# Altium schematic sheet Core.SchDoc
size A3; SheetNumber: 1; SheetTotal: 3
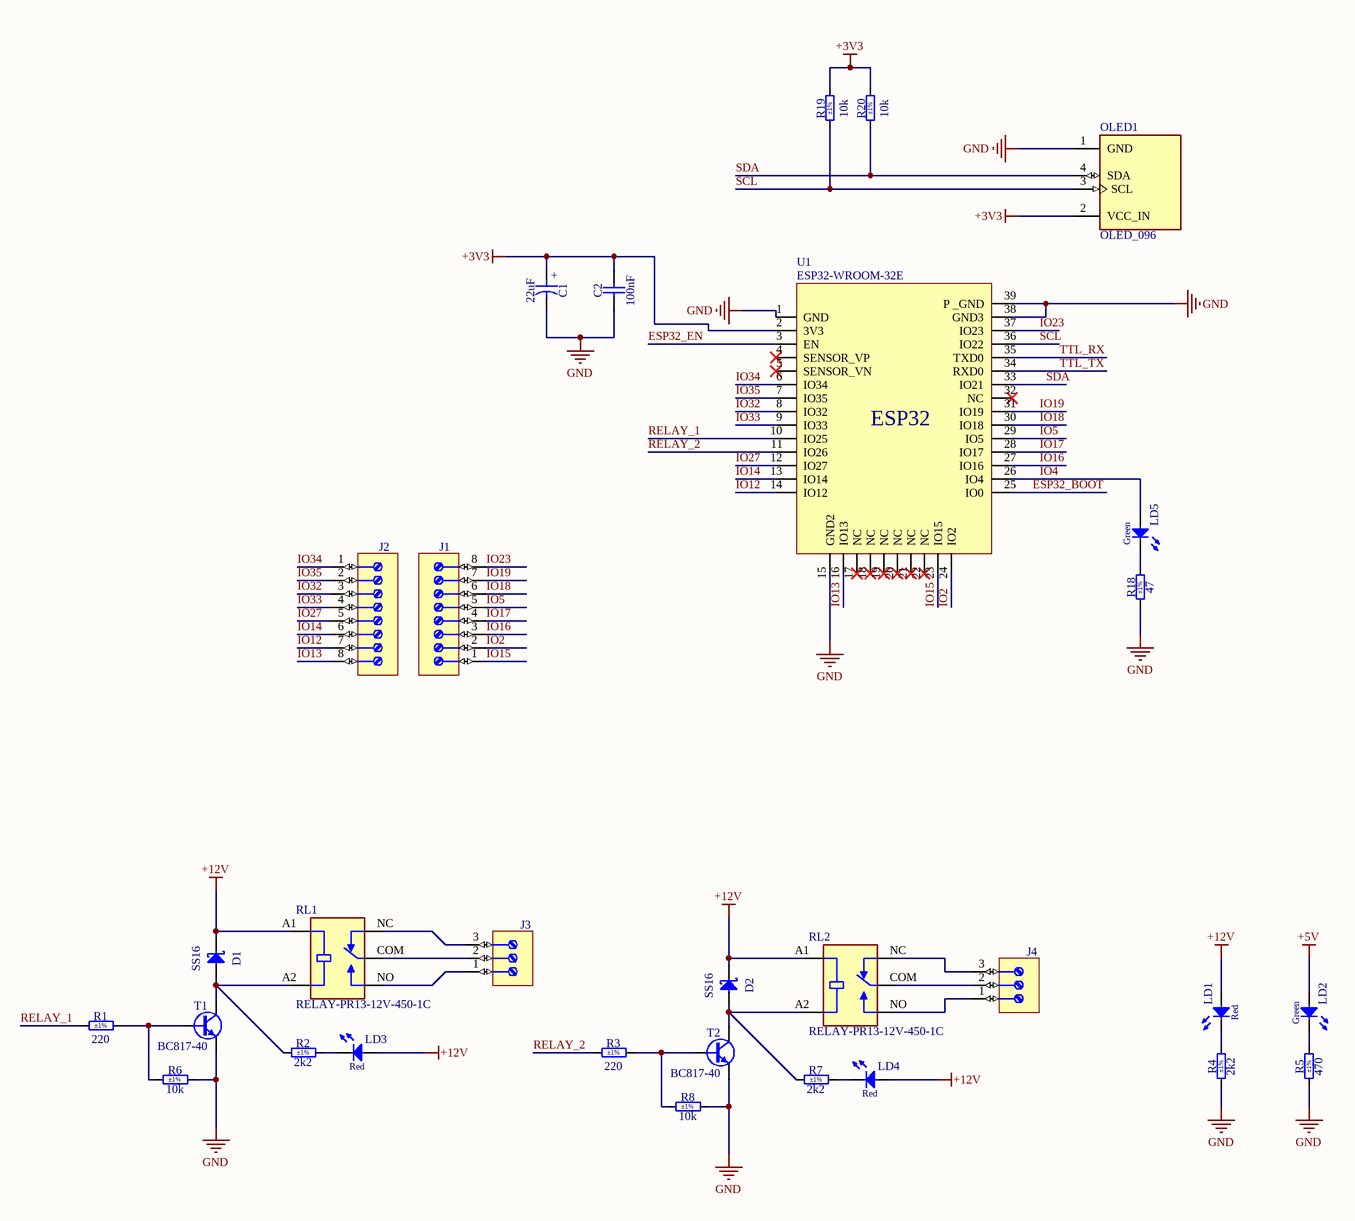
[diagram p0: Core.SchDoc]

## Parts
C1  22uF  [CAPMP3528X210N]
C2  100nF  [CAPC1608X87N]
D1  SS16  [DIOM5127X229N]
D2  SS16  [DIOM5127X229N]
J1  (no value)  [PHOENIX_1715789]
J2  (no value)  [PHOENIX_1715789]
J3  (no value)  [PHOENIX_1715734]
J4  (no value)  [PHOENIX_1715734]
LD1  Red  [LED_KINGBRIGHT_KPH-1608SURCK]
LD2  Green  [LED_KINGBRIGHT_KP-1608CGCK]
LD3  Red  [LED_KINGBRIGHT_KPH-1608SURCK]
LD4  Red  [LED_KINGBRIGHT_KPH-1608SURCK]
LD5  Green  [LED_KINGBRIGHT_KP-1608CGCK]
OLED1  OLED_096  [OLED096]
R1  220  Tolerance: ±1%  [RESC1608X55N]
R2  2k2  Tolerance: ±1%  [RESC1608X55N]
R3  220  Tolerance: ±1%  [RESC1608X55N]
R4  2k2  Tolerance: ±1%  [RESC1608X55N]
R5  470  Tolerance: ±1%  [RESC1608X55N]
R6  10k  Tolerance: ±1%  [RESC1608X55N]
R7  2k2  Tolerance: ±1%  [RESC1608X55N]
R8  10k  Tolerance: ±1%  [RESC1608X55N]
R18  47  Tolerance: ±1%  [RESC1608X55N]
R19  10k  Tolerance: ±1%  [RESC1608X55N]
R20  10k  Tolerance: ±1%  [RESC1608X55N]
RL1  RELAY-PR13-12V-450-1C  [RELAY_PR13-12V-450-1C]
RL2  RELAY-PR13-12V-450-1C  [RELAY_PR13-12V-450-1C]
T1  BC817-40  [SOT95P230X110-3N]
T2  BC817-40  [SOT95P230X110-3N]
U1  ESP32-WROOM-32E  [ESP32]

## Nets
+3V3: C1.1 C2.2 OLED1.2(VCC_IN) R19.2 R20.2 U1.2(3V3)
+5V: LD2.2(A)
+12V: D1.1(C) D2.1(C) LD1.2(A) LD3.2(A) LD4.2(A) RL1.A1(COIL1) RL2.A1(COIL1)
GND: C1.2 C2.1 OLED1.1(GND) R4.1 R5.1 R6.2 R8.2 R18.1 T1.2(E) T2.2(E) U1.1(GND) U1.15(GND2) U1.38(GND3) U1.39(P__GND)
ESP32_BOOT: U1.25(IO0)
ESP32_EN: U1.3(EN)
IO2: J1.2 U1.24(IO2)
IO4: LD5.2(A) U1.26(IO4)
IO5: J1.5 U1.29(IO5)
IO12: J2.7 U1.14(IO12)
IO13: J2.8 U1.16(IO13)
IO14: J2.6 U1.13(IO14)
IO15: J1.1 U1.23(IO15)
IO16: J1.3 U1.27(IO16)
IO17: J1.4 U1.28(IO17)
IO18: J1.6 U1.30(IO18)
IO19: J1.7 U1.31(IO19)
IO23: J1.8 U1.37(IO23)
IO27: J2.5 U1.12(IO27)
IO32: J2.3 U1.8(IO32)
IO33: J2.4 U1.9(IO33)
IO34: J2.1 U1.6(IO34)
IO35: J2.2 U1.7(IO35)
RELAY_1: R1.1 U1.10(IO25)
RELAY_2: R3.1 U1.11(IO26)
SCL: OLED1.3(SCL) R19.1 U1.36(IO22)
SDA: OLED1.4(SDA) R20.1 U1.33(IO21)
TTL_RX: U1.35(TXD0)
TTL_TX: U1.34(RXD0)
NetD1_2: D1.2(A) R2.1 RL1.A2(COIL2) T1.3(C)
NetD2_2: D2.2(A) R7.1 RL2.A2(COIL2) T2.3(C)
NetJ3_1: J3.1 RL1.NO
NetJ3_2: J3.2 RL1.COM
NetJ3_3: J3.3 RL1.NC
NetJ4_1: J4.1 RL2.NO
NetJ4_2: J4.2 RL2.COM
NetJ4_3: J4.3 RL2.NC
NetLD1_1: LD1.1(C) R4.2
NetLD2_1: LD2.1(C) R5.2
NetLD3_1: LD3.1(C) R2.2
NetLD4_1: LD4.1(C) R7.2
NetLD5_1: LD5.1(C) R18.2
NetR1_2: R1.2 R6.1 T1.1(B)
NetR3_2: R3.2 R8.1 T2.1(B)

Not connected (* = marked no-connect by the designer): U1 4(SENSOR_VP)* 5(SENSOR_VN)* 17(NC)* 18(NC)* 19(NC)* 20(NC)* 21(NC)* 22(NC)* 32(NC)*

## Notes on the sheet
- (in symbol CTE3528-21_22UF_10V_10%_LESR0700) +
- (in symbol ESP32-WROOM-32E) ESP32

## Library data of the parts
C1 = CTE3528-21_22UF_10V_10%_LESR0700: Polarised capacitor; Part Description: Low ESR 0R7 Solid Tantalum Chip Capacitor; Manufacturer: GENERIC; Manufacturer1 Part Number: TPSB226K010R0700; Voltage: 10V; Tolerance: ±10%; Part Number: CTE3528-21_22UF_10V_10%_LESR0700; Component Kind: Standard; Component Type: Standard; Pin Count: 2; Value: 22uF; Status: Preferred; Manufacturer Part Number: CTE3528-21_22UF_10V_10%_LESR0700; Case: B; Mounted: Yes; Socket: No; SMD: Yes; Sense: No; Manufacturer1 Example: AVX; Manufacturer1 ComponentHeight: 2.1mm; HelpURL: \\cern.ch\dfs\Applications\Altium\Datasheets\CTE-LESR_AVX_TPS.pdf; Author: CERN DEM JLC; CreateDate: 5.05.2008; LatestRevisionDate: 20.01.2009
C2 = CC0603_100NF_50V_10%_X5R: Non-polarised capacitor; Part Description: SMD Multilayer Chip Ceramic Capacitor; Manufacturer: GENERIC; Manufacturer1 Part Number: C1608X5R1H104K080; Voltage: 50V; TC: X5R; Tolerance: ±10%; Part Number: CC0603_100NF_50V_10%_X5R; Component Kind: Standard; Component Type: Standard; Pin Count: 2; Value: 100nF; Status: None; Manufacturer Part Number: CC0603_100NF_50V_10%_X5R; Case: 0603; Mounted: Yes; Socket: No; SMD: Yes; Sense: No; Manufacturer1 Example: TDK; Manufacturer1 ComponentHeight: 0.9mm; HelpURL: \\cern.ch\dfs\Applications\Altium\Datasheets\CC0603_X5R_TDK_C.pdf; Author: CERN DEM MR; CreateDate: 8.01.2016; LatestRevisionDate: 8.01.2016
D1 D2 = SS16: Schottky Diode; Part Description: Surface Mount Schottky Barrier Rectifier; Manufacturer: VISHAY GENERAL SEMICONDUCTOR; Voltage: 60V; Power: 1A; PressFit: No; Bonding: No; Part Number: SS16; Component Kind: Standard; Component Type: Standard; Device: SS16; PackageDescription: DO-214-AC/SMA Diode, Molded Body; 5.10mm L X 2.67mm W X 2.29mm H, IPC Medium Density; Manufacturer Part Number: SS16; Pin Count: 2; Case: DO-214AC; Mounted: Yes; Socket: No; SMD: Yes; Sense: No; ComponentHeight: 2.29mm; HelpURL: \\cern.ch\dfs\Applications\Altium\Datasheets\SS16.pdf; Author: CERN DEM JLC; CreateDate: 15.07.2008; LatestRevisionDate: 23.08.2010
J1 J2 = PHOENIX_1715789: Terminal Block, 8 Positions, Screw Connection; Part Description: 17.5A, 400V, Terminal Block, Pitch 5.08mm, 8 Positions, Screw Connection; Manufacturer: PHOENIX CONTACT; Manufacturer Part Number: 1715789 (MKDS 1,5/8-5,08); PressFit: No; Part Number: PHOENIX_1715789; Component Kind: Standard; Component Type: Standard; Pin Count: 8; Mounted: Yes; Socket: No; SMD: No; Sense: No; Status: None; ComponentHeight: 13.8mm; HelpURL: \\cern.ch\dfs\Applications\Altium\Datasheets\PHOENIX_1715789.pdf; Author: CERN DEM JMW; CreateDate: 25.02.2013; LatestRevisionDate: 25.02.2013
J3 J4 = PHOENIX_1715734: Terminal Block, 3 Positions, Screw Connection; Part Description: 17.5A, 400V, Terminal Block, Pitch 5.08mm, 3 Positions, Screw Connection; Manufacturer: PHOENIX CONTACT; Manufacturer Part Number: 1715734 (MKDS 1,5/3-5,08); PressFit: No; Part Number: PHOENIX_1715734; Component Kind: Standard; Component Type: Standard; Pin Count: 3; Mounted: Yes; Socket: No; SMD: No; Sense: No; Status: None; ComponentHeight: 13.8mm; HelpURL: \\cern.ch\dfs\Applications\Altium\Datasheets\PHOENIX_1715734.pdf; Author: CERN DEM JLC; CreateDate: 6.01.2010; LatestRevisionDate: 25.02.2013
LD1 LD3 LD4 = LED_KINGBRIGHT_KPH-1608SURCK: LED Red 1C 2A; Part Description: SMD Hyper Red LED, Case 1.6mmX0.8mm(0603), 0.65mm Thickness; PressFit: No; Bonding: No; Part Number: LED_KINGBRIGHT_KPH-1608SURCK; Component Kind: Standard; Component Type: Standard; Color: Red; PackageDescription: SMT Hyper Red LED, Case 0603, Body L 1.6 x W 0.8mm H 0.65mm; Manufacturer: KINGBRIGHT; Manufacturer Part Number: KPH-1608SURCK; Pin Count: 2; Case: 0603; Mounted: Yes; Socket: No; SMD: Yes; Sense: No; ComponentHeight: 0.65mm; HelpURL: \\cern.ch\dfs\Applications\Altium\Datasheets\LED_KINGBRIGHT_KPH-1608SURCK.pdf; Author: CERN DEM JLC; CreateDate: 3.07.2017; LatestRevisionDate: 3.07.2017
LD2 LD5 = LED_KINGBRIGHT_KP-1608CGCK: LED Green 1C 2A; Part Description: 1.6x0.8mm SMD Chip Green LED Lamp; PressFit: No; Bonding: No; Part Number: LED_KINGBRIGHT_KP-1608CGCK; Component Kind: Standard; Component Type: Standard; Color: Green; PackageDescription: SMT Green LED, Case 0603, Body L 1.60mm x W 0.80mm x H 1.10mm; Manufacturer: KINGBRIGHT; Manufacturer Part Number: KP-1608CGCK; Pin Count: 2; Case: 0603; Mounted: Yes; Socket: No; SMD: Yes; Sense: No; ComponentHeight: 1.1mm; HelpURL: \\cern.ch\dfs\Applications\Altium\Datasheets\LED_KINGBRIGHT_KP-1608CGCK.pdf; Author: CERN DEM HF; CreateDate: 1.10.2021; LatestRevisionDate: 1.10.2021
R1 R3 = R0603_220R_1%_0.1W_100PPM: Resistor - 1%; Part Description: General Purpose Thick Film Chip Resistor; Manufacturer: GENERIC; Manufacturer1 Part Number: NRC06F2200TRF; Power: 0.1W; TC: ±100ppm/°C; PressFit: No; Part Number: R0603_220R_1%_0.1W_100PPM; Component Kind: Standard; Component Type: Standard; Pin Count: 2; Value: 220; Status: Preferred; Manufacturer Part Number: R0603_220R_1%_0.1W_100PPM; Case: 0603; Mounted: Yes; Sense: No; Socket: No; SMD: Yes; Manufacturer1 Example: NIC COMPONENT; Manufacturer1 ComponentHeight: 0.55mm; HelpURL: \\cern.ch\dfs\Applications\Altium\Datasheets\R0603_NIC_NRC.pdf; Author: CERN DEM JLC; CreateDate: 3.12.2007; LatestRevisionDate: 13.03.2008
R2 R4 R7 = R0603_2K2_1%_0.1W_100PPM: Resistor - 1%; Part Description: General Purpose Thick Film Chip Resistor; Manufacturer: GENERIC; Manufacturer1 Part Number: NRC06F2201TRF; Power: 0.1W; TC: ±100ppm/°C; PressFit: No; Part Number: R0603_2K2_1%_0.1W_100PPM; Component Kind: Standard; Component Type: Standard; Pin Count: 2; Value: 2k2; Status: Preferred; Manufacturer Part Number: R0603_2K2_1%_0.1W_100PPM; Case: 0603; Mounted: Yes; Sense: No; Socket: No; SMD: Yes; Manufacturer1 Example: NIC COMPONENT; Manufacturer1 ComponentHeight: 0.55mm; HelpURL: \\cern.ch\dfs\Applications\Altium\Datasheets\R0603_NIC_NRC.pdf; Author: CERN DEM JLC; CreateDate: 3.12.2007; LatestRevisionDate: 13.03.2008
R5 = R0603_470R_1%_0.1W_100PPM: Resistor - 1%; Part Description: General Purpose Thick Film Chip Resistor; Manufacturer: GENERIC; Manufacturer1 Part Number: NRC06F4700TRF; Power: 0.1W; TC: ±100ppm/°C; PressFit: No; Part Number: R0603_470R_1%_0.1W_100PPM; Component Kind: Standard; Component Type: Standard; Pin Count: 2; Value: 470; Status: Preferred; Manufacturer Part Number: R0603_470R_1%_0.1W_100PPM; Case: 0603; Mounted: Yes; Sense: No; Socket: No; SMD: Yes; Manufacturer1 Example: NIC COMPONENT; Manufacturer1 ComponentHeight: 0.55mm; HelpURL: \\cern.ch\dfs\Applications\Altium\Datasheets\R0603_NIC_NRC.pdf; Author: CERN DEM JLC; CreateDate: 3.12.2007; LatestRevisionDate: 13.03.2008
R6 R8 R19 R20 = R0603_10K_1%_0.1W_100PPM: Resistor - 1%; Part Description: General Purpose Thick Film Chip Resistor; Manufacturer: GENERIC; Manufacturer1 Part Number: NRC06F1002TRF; Power: 0.1W; TC: ±100ppm/°C; PressFit: No; Part Number: R0603_10K_1%_0.1W_100PPM; Component Kind: Standard; Component Type: Standard; Pin Count: 2; Value: 10k; Status: Preferred; Manufacturer Part Number: R0603_10K_1%_0.1W_100PPM; Case: 0603; Mounted: Yes; Sense: No; Socket: No; SMD: Yes; Manufacturer1 Example: NIC COMPONENT; Manufacturer1 ComponentHeight: 0.55mm; HelpURL: \\cern.ch\dfs\Applications\Altium\Datasheets\R0603_NIC_NRC.pdf; Author: CERN DEM JLC; CreateDate: 3.12.2007; LatestRevisionDate: 13.03.2008
R18 = R0603_47R_1%_0.1W_100PPM: Resistor - 1%; Part Description: General Purpose Thick Film Chip Resistor; Manufacturer: GENERIC; Manufacturer1 Part Number: NRC06F47R0TRF; Power: 0.1W; TC: ±100ppm/°C; PressFit: No; Part Number: R0603_47R_1%_0.1W_100PPM; Component Kind: Standard; Component Type: Standard; Pin Count: 2; Value: 47; Status: Preferred; Manufacturer Part Number: R0603_47R_1%_0.1W_100PPM; Case: 0603; Mounted: Yes; Sense: No; Socket: No; SMD: Yes; Manufacturer1 Example: NIC COMPONENT; Manufacturer1 ComponentHeight: 0.55mm; HelpURL: \\cern.ch\dfs\Applications\Altium\Datasheets\R0603_NIC_NRC.pdf; Author: CERN DEM JLC; CreateDate: 3.12.2007; LatestRevisionDate: 13.03.2008
T1 T2 = BC817-40: NPN Transistor; Part Description: 45V 500mA NPN General-Purpose Transistor; Manufacturer: NXP SEMICONDUCTORS; PressFit: No; Bonding: No; Part Number: BC817-40; Component Kind: Standard; Component Type: Standard; Device: BC817-40; PackageDescription: SOT23, 0.95mm Pitch; 3 Pin, 1.30mm W X 2.90mm L X 1.10mm H body, IPC Medium Density; Manufacturer Part Number: BC817-40; Pin Count: 3; Case: SOT23-3; Mounted: Yes; Socket: No; SMD: Yes; Sense: No; ComponentHeight: 1.1mm; HelpURL: \\cern.ch\dfs\Applications\Altium\Datasheets\BC817-40.pdf; Author: CERN DEM BC; CreateDate: 29.04.2020; LatestRevisionDate: 29.04.2020